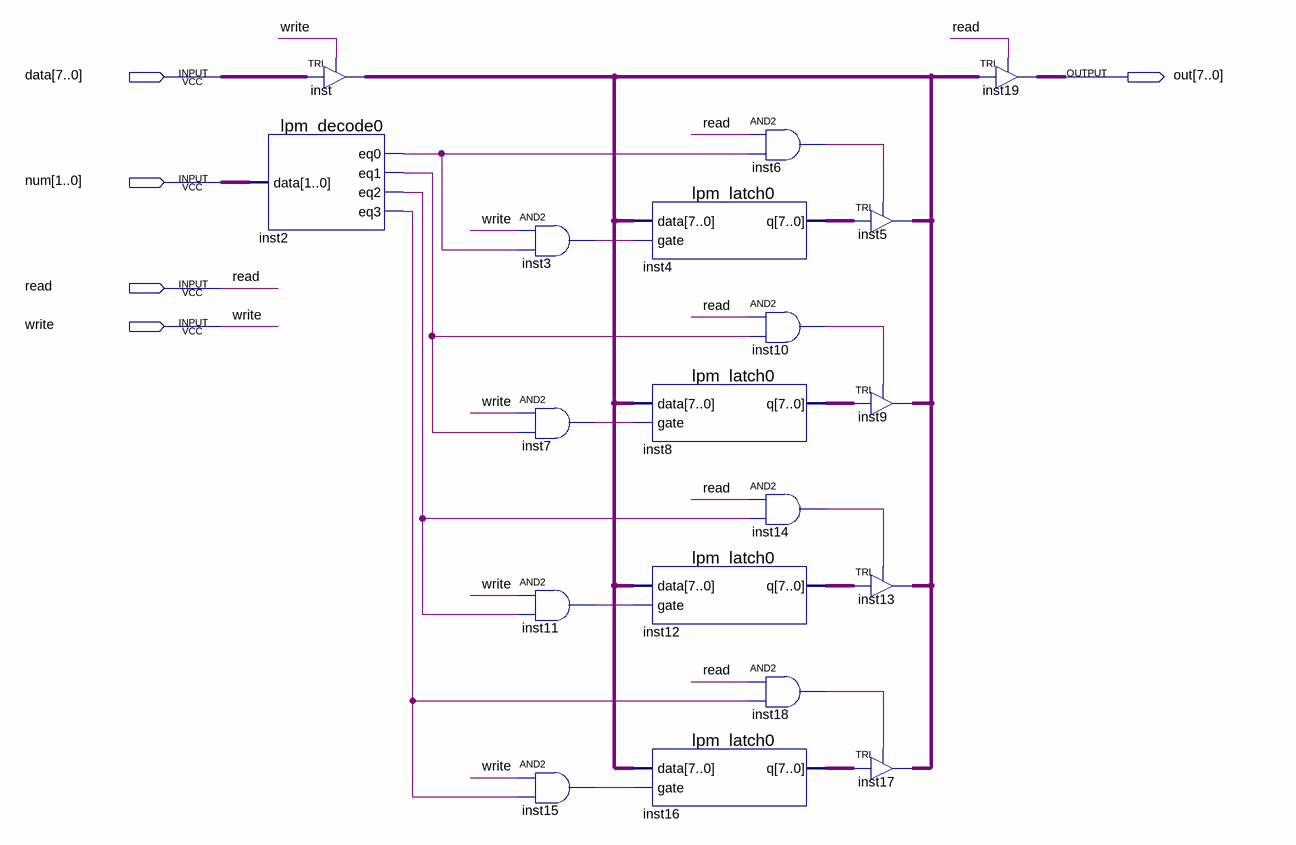
[diagram p0: schematic sheet]
// Quartus schematic RON.bdf as structural Verilog: 19 symbols, 5 pins
module RON (
  input  [7:0] data,
  input  [1:0] num,
  input  read,
  input  write,
  output [7:0] out
);

  wire inst2_eq0, inst2_eq1, inst2_eq2, inst2_eq3, inst3_out, inst6_out, inst7_out, inst10_out, inst11_out,
       inst14_out, inst15_out, inst18_out;
  wire [7:0] inst4_q, inst8_q, inst12_q, inst16_q, inst_out;

  TRI inst[7:0] (.IN(data), .OE(write), .OUT(inst_out));
  lpm_decode0 inst2 (.data(num), .eq0(inst2_eq0), .eq1(inst2_eq1), .eq2(inst2_eq2), .eq3(inst2_eq3));
  and inst3 (inst3_out, write, inst2_eq0);
  and inst7 (inst7_out, write, inst2_eq1);
  and inst11 (inst11_out, write, inst2_eq2);
  and inst15 (inst15_out, write, inst2_eq3);
  lpm_latch0 inst4 (.data(inst_out), .gate(inst3_out), .q(inst4_q));
  lpm_latch0 inst8 (.data(inst_out), .gate(inst7_out), .q(inst8_q));
  lpm_latch0 inst12 (.data(inst_out), .gate(inst11_out), .q(inst12_q));
  lpm_latch0 inst16 (.data(inst_out), .gate(inst15_out), .q(inst16_q));
  and inst6 (inst6_out, read, inst2_eq0);
  and inst10 (inst10_out, read, inst2_eq1);
  and inst14 (inst14_out, read, inst2_eq2);
  and inst18 (inst18_out, read, inst2_eq3);
  TRI inst5[7:0] (.IN(inst4_q), .OE(inst6_out), .OUT(inst_out));
  TRI inst9[7:0] (.IN(inst8_q), .OE(inst10_out), .OUT(inst_out));
  TRI inst13[7:0] (.IN(inst12_q), .OE(inst14_out), .OUT(inst_out));
  TRI inst17[7:0] (.IN(inst16_q), .OE(inst18_out), .OUT(inst_out));
  TRI inst19[7:0] (.IN(inst_out), .OE(read), .OUT(out));
endmodule
